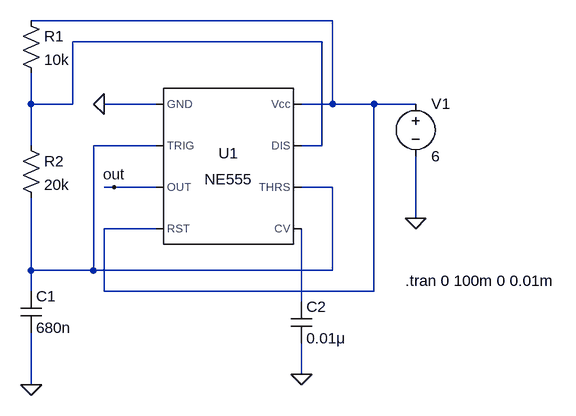
[diagram p0: schematic 555.asc]
555.asc, the LTspice schematic file:
Version 4
SHEET 1 1792 848
WIRE 1312 272 848 272
WIRE 1296 304 912 304
WIRE 848 400 848 352
WIRE 912 400 912 304
WIRE 912 400 848 400
WIRE 1040 400 960 400
WIRE 1312 400 1312 272
WIRE 1312 400 1264 400
WIRE 1376 400 1312 400
WIRE 1440 400 1376 400
WIRE 848 464 848 400
WIRE 1040 464 944 464
WIRE 1296 464 1296 304
WIRE 1296 464 1264 464
WIRE 976 528 960 528
WIRE 1040 528 976 528
WIRE 1312 528 1264 528
WIRE 1440 576 1440 480
WIRE 1040 592 960 592
WIRE 848 656 848 544
WIRE 944 656 944 464
WIRE 944 656 848 656
WIRE 1312 656 1312 528
WIRE 1312 656 944 656
WIRE 848 688 848 656
WIRE 960 688 960 592
WIRE 1376 688 1376 400
WIRE 1376 688 960 688
WIRE 1264 704 1264 592
WIRE 1264 816 1264 768
WIRE 848 832 848 752
FLAG 960 400 0
FLAG 1264 816 0
FLAG 1440 576 0
FLAG 848 832 0
FLAG 976 528 out
SYMBOL Misc/NE555 1152 496 R0
SYMATTR InstName U1
SYMBOL res 832 256 R0
SYMATTR InstName R1
SYMATTR Value 10k
SYMBOL res 832 448 R0
SYMATTR InstName R2
SYMATTR Value 20k
SYMBOL cap 832 688 R0
SYMATTR InstName C1
SYMATTR Value 680n
SYMBOL cap 1248 704 R0
SYMATTR InstName C2
SYMATTR Value 0.01μ
SYMBOL voltage 1440 384 R0
SYMATTR InstName V1
SYMATTR Value 6
TEXT 1424 672 Left 2 !.tran 0 100m 0 0.01m

The netlist it stands for:
* 555.asc
XU1 0 N003 out N001 N004 N003 N002 N001 NE555  ; pins GND TRIG OUT RST CV THRS DIS Vcc
R1 N001 N002 10k
R2 N002 N003 20k
C1 N003 0 680n
C2 N004 0 0.01μ
V1 N001 0 6
.tran 0 100m 0 0.01m
.lib NE555.sub
.backanno
.end